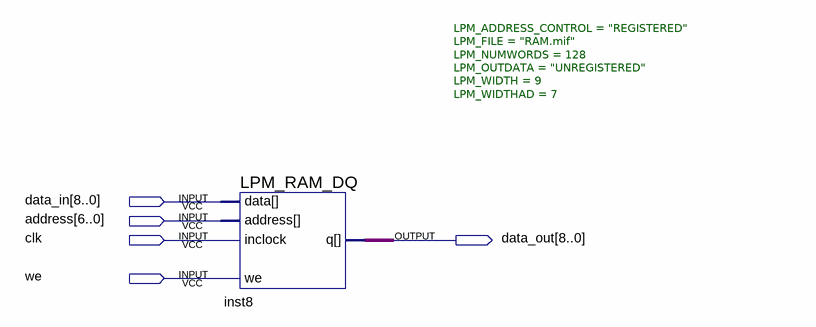
[diagram p0: schematic sheet]
// Quartus schematic RAM_test.bdf as structural Verilog: 1 symbols, 5 pins
module RAM_test (
  input  [8:0] data_in,
  input  [6:0] address,
  input  clk,
  input  we,
  output [8:0] data_out
);

  LPM_RAM_DQ #(.LPM_ADDRESS_CONTROL("REGISTERED"), .LPM_FILE("RAM.mif"), .LPM_NUMWORDS(128), .LPM_OUTDATA("UNREGISTERED"), .LPM_WIDTH(9), .LPM_WIDTHAD(7)) inst8 (
    .inclock(clk), .data(data_in), .address(address), .we(we), .q(data_out));
endmodule
